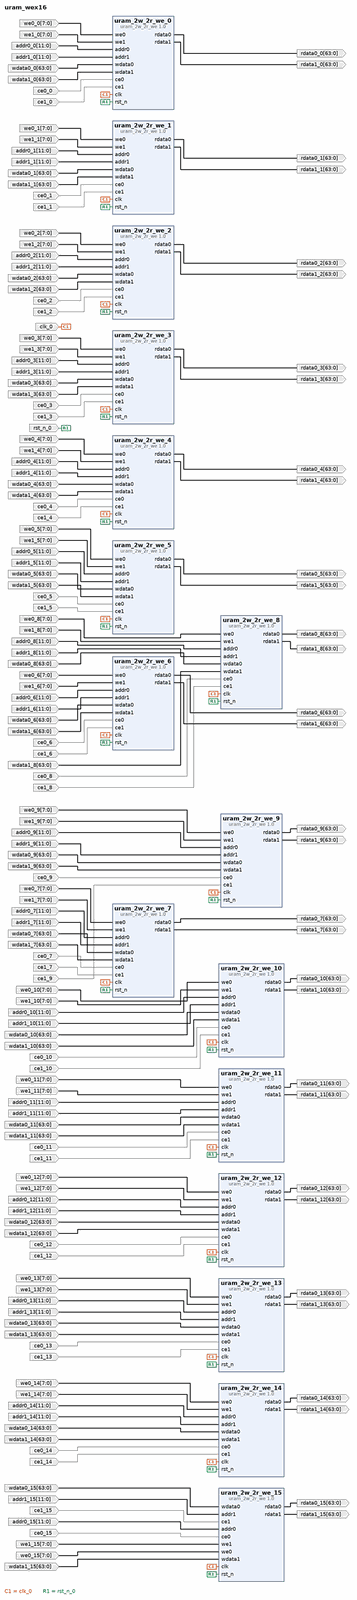
[diagram p0: block diagram of the top level, whole]
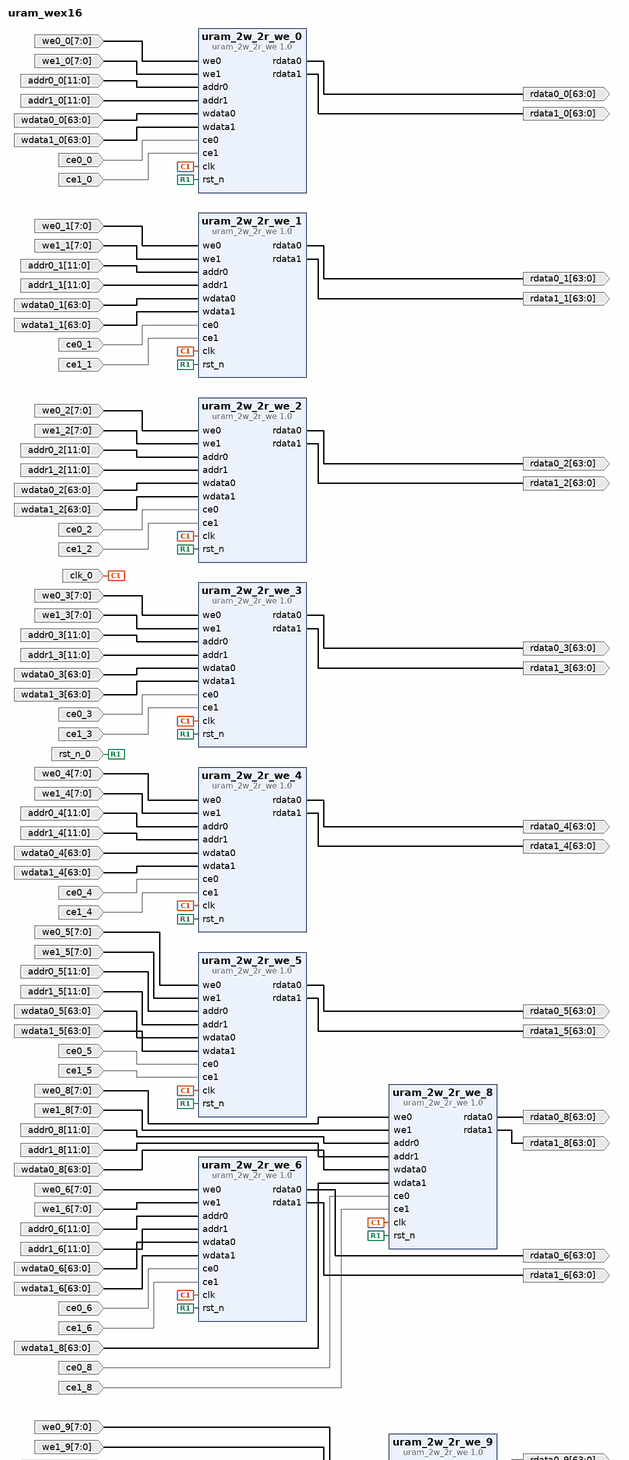
[diagram p1: block diagram of the top level, upper part]
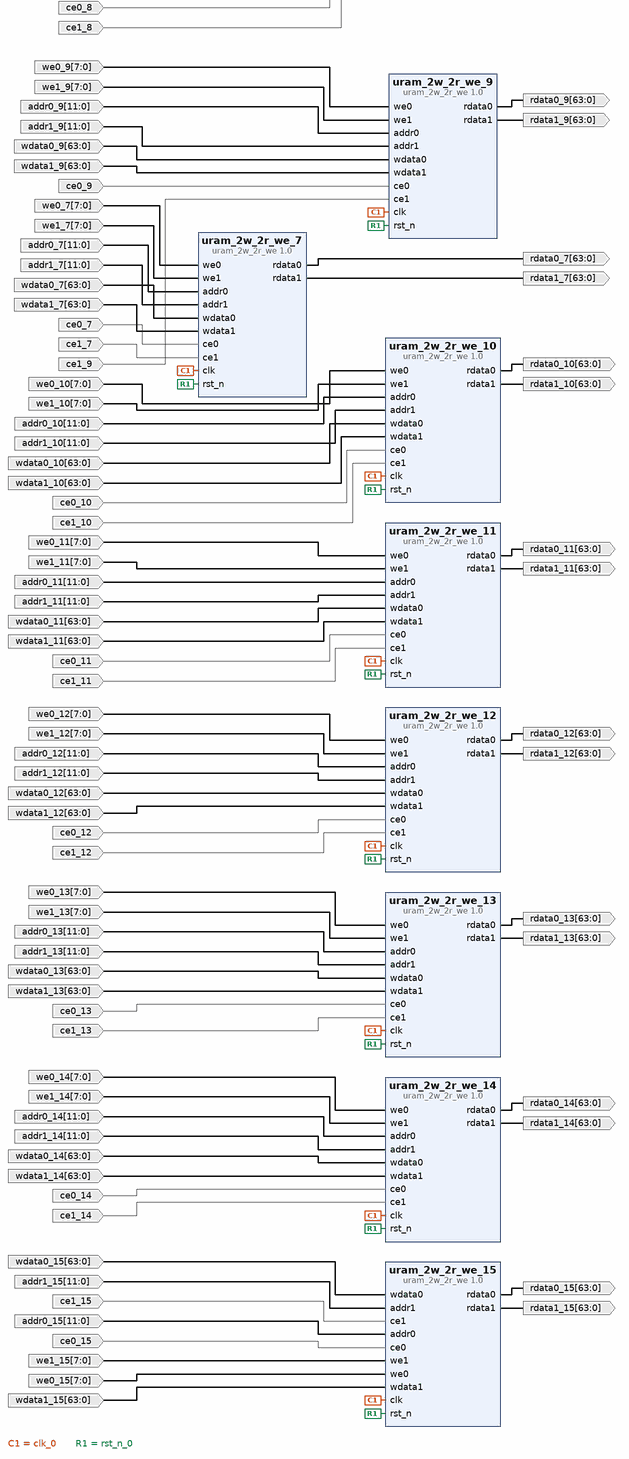
[diagram p2: block diagram of the top level, lower part]
# Vivado block design uram_wex16, xcu280-fsvh2892-2L-e, Vivado 2020.2
create_bd_design uram_wex16

create_bd_port -dir I -type clk clk_0
create_bd_port -dir I -type rst rst_n_0
create_bd_port -dir I -from 7 -to 0 we0_0
create_bd_port -dir I -from 7 -to 0 we1_0
create_bd_port -dir I -from 11 -to 0 addr0_0
create_bd_port -dir I -from 11 -to 0 addr1_0
create_bd_port -dir O -from 63 -to 0 rdata0_0
create_bd_port -dir O -from 63 -to 0 rdata1_0
create_bd_port -dir I -from 63 -to 0 wdata0_0
create_bd_port -dir I -from 63 -to 0 wdata1_0
create_bd_port -dir I ce0_0
create_bd_port -dir I ce1_0
create_bd_port -dir I -from 7 -to 0 we0_1
create_bd_port -dir I -from 7 -to 0 we1_1
create_bd_port -dir I -from 11 -to 0 addr0_1
create_bd_port -dir I -from 11 -to 0 addr1_1
create_bd_port -dir O -from 63 -to 0 rdata0_1
create_bd_port -dir O -from 63 -to 0 rdata1_1
create_bd_port -dir I -from 63 -to 0 wdata0_1
create_bd_port -dir I -from 63 -to 0 wdata1_1
create_bd_port -dir I ce0_1
create_bd_port -dir I ce1_1
create_bd_port -dir I -from 7 -to 0 we0_2
create_bd_port -dir I -from 7 -to 0 we1_2
create_bd_port -dir I -from 11 -to 0 addr0_2
create_bd_port -dir I -from 11 -to 0 addr1_2
create_bd_port -dir O -from 63 -to 0 rdata0_2
create_bd_port -dir O -from 63 -to 0 rdata1_2
create_bd_port -dir I -from 63 -to 0 wdata0_2
create_bd_port -dir I -from 63 -to 0 wdata1_2
create_bd_port -dir I ce0_2
create_bd_port -dir I ce1_2
create_bd_port -dir I -from 7 -to 0 we0_3
create_bd_port -dir I -from 7 -to 0 we1_3
create_bd_port -dir I -from 11 -to 0 addr0_3
create_bd_port -dir I -from 11 -to 0 addr1_3
create_bd_port -dir O -from 63 -to 0 rdata0_3
create_bd_port -dir O -from 63 -to 0 rdata1_3
create_bd_port -dir I -from 63 -to 0 wdata0_3
create_bd_port -dir I -from 63 -to 0 wdata1_3
create_bd_port -dir I ce0_3
create_bd_port -dir I ce1_3
create_bd_port -dir I -from 7 -to 0 we0_4
create_bd_port -dir I -from 7 -to 0 we1_4
create_bd_port -dir I -from 11 -to 0 addr0_4
create_bd_port -dir I -from 11 -to 0 addr1_4
create_bd_port -dir O -from 63 -to 0 rdata0_4
create_bd_port -dir O -from 63 -to 0 rdata1_4
create_bd_port -dir I -from 63 -to 0 wdata0_4
create_bd_port -dir I -from 63 -to 0 wdata1_4
create_bd_port -dir I ce0_4
create_bd_port -dir I ce1_4
create_bd_port -dir I -from 7 -to 0 we0_5
create_bd_port -dir I -from 7 -to 0 we1_5
create_bd_port -dir I -from 11 -to 0 addr0_5
create_bd_port -dir I -from 11 -to 0 addr1_5
create_bd_port -dir O -from 63 -to 0 rdata0_5
create_bd_port -dir O -from 63 -to 0 rdata1_5
create_bd_port -dir I -from 63 -to 0 wdata0_5
create_bd_port -dir I -from 63 -to 0 wdata1_5
create_bd_port -dir I ce0_5
create_bd_port -dir I ce1_5
create_bd_port -dir I -from 7 -to 0 we0_6
create_bd_port -dir I -from 7 -to 0 we1_6
create_bd_port -dir I -from 11 -to 0 addr0_6
create_bd_port -dir I -from 11 -to 0 addr1_6
create_bd_port -dir O -from 63 -to 0 rdata0_6
create_bd_port -dir O -from 63 -to 0 rdata1_6
create_bd_port -dir I -from 63 -to 0 wdata0_6
create_bd_port -dir I -from 63 -to 0 wdata1_6
create_bd_port -dir I ce0_6
create_bd_port -dir I ce1_6
create_bd_port -dir I -from 7 -to 0 we0_7
create_bd_port -dir I -from 7 -to 0 we1_7
create_bd_port -dir I -from 11 -to 0 addr0_7
create_bd_port -dir I -from 11 -to 0 addr1_7
create_bd_port -dir O -from 63 -to 0 rdata0_7
create_bd_port -dir O -from 63 -to 0 rdata1_7
create_bd_port -dir I -from 63 -to 0 wdata0_7
create_bd_port -dir I -from 63 -to 0 wdata1_7
create_bd_port -dir I ce0_7
create_bd_port -dir I ce1_7
create_bd_port -dir I -from 7 -to 0 we0_8
create_bd_port -dir I -from 7 -to 0 we1_8
create_bd_port -dir I -from 11 -to 0 addr0_8
create_bd_port -dir I -from 11 -to 0 addr1_8
create_bd_port -dir O -from 63 -to 0 rdata0_8
create_bd_port -dir O -from 63 -to 0 rdata1_8
create_bd_port -dir I -from 63 -to 0 wdata0_8
create_bd_port -dir I -from 63 -to 0 wdata1_8
create_bd_port -dir I ce0_8
create_bd_port -dir I ce1_8
create_bd_port -dir I -from 7 -to 0 we0_9
create_bd_port -dir I -from 7 -to 0 we1_9
create_bd_port -dir I -from 11 -to 0 addr0_9
create_bd_port -dir I -from 11 -to 0 addr1_9
create_bd_port -dir O -from 63 -to 0 rdata0_9
create_bd_port -dir O -from 63 -to 0 rdata1_9
create_bd_port -dir I -from 63 -to 0 wdata0_9
create_bd_port -dir I -from 63 -to 0 wdata1_9
create_bd_port -dir I ce0_9
create_bd_port -dir I ce1_9
create_bd_port -dir I -from 7 -to 0 we0_10
create_bd_port -dir I -from 7 -to 0 we1_10
create_bd_port -dir I -from 11 -to 0 addr0_10
create_bd_port -dir I -from 11 -to 0 addr1_10
create_bd_port -dir O -from 63 -to 0 rdata0_10
create_bd_port -dir O -from 63 -to 0 rdata1_10
create_bd_port -dir I -from 63 -to 0 wdata0_10
create_bd_port -dir I -from 63 -to 0 wdata1_10
create_bd_port -dir I ce0_10
create_bd_port -dir I ce1_10
create_bd_port -dir I -from 7 -to 0 we0_11
create_bd_port -dir I -from 7 -to 0 we1_11
create_bd_port -dir I -from 11 -to 0 addr0_11
create_bd_port -dir I -from 11 -to 0 addr1_11
create_bd_port -dir O -from 63 -to 0 rdata0_11
create_bd_port -dir O -from 63 -to 0 rdata1_11
create_bd_port -dir I -from 63 -to 0 wdata0_11
create_bd_port -dir I -from 63 -to 0 wdata1_11
create_bd_port -dir I ce0_11
create_bd_port -dir I ce1_11
create_bd_port -dir I -from 7 -to 0 we0_12
create_bd_port -dir I -from 7 -to 0 we1_12
create_bd_port -dir I -from 11 -to 0 addr0_12
create_bd_port -dir I -from 11 -to 0 addr1_12
create_bd_port -dir O -from 63 -to 0 rdata0_12
create_bd_port -dir O -from 63 -to 0 rdata1_12
create_bd_port -dir I -from 63 -to 0 wdata0_12
create_bd_port -dir I -from 63 -to 0 wdata1_12
create_bd_port -dir I ce0_12
create_bd_port -dir I ce1_12
create_bd_port -dir I -from 7 -to 0 we0_13
create_bd_port -dir I -from 7 -to 0 we1_13
create_bd_port -dir I -from 11 -to 0 addr0_13
create_bd_port -dir I -from 11 -to 0 addr1_13
create_bd_port -dir O -from 63 -to 0 rdata0_13
create_bd_port -dir O -from 63 -to 0 rdata1_13
create_bd_port -dir I -from 63 -to 0 wdata0_13
create_bd_port -dir I -from 63 -to 0 wdata1_13
create_bd_port -dir I ce0_13
create_bd_port -dir I ce1_13
create_bd_port -dir I -from 7 -to 0 we0_14
create_bd_port -dir I -from 7 -to 0 we1_14
create_bd_port -dir I -from 11 -to 0 addr0_14
create_bd_port -dir I -from 11 -to 0 addr1_14
create_bd_port -dir O -from 63 -to 0 rdata0_14
create_bd_port -dir O -from 63 -to 0 rdata1_14
create_bd_port -dir I -from 63 -to 0 wdata0_14
create_bd_port -dir I -from 63 -to 0 wdata1_14
create_bd_port -dir I ce0_14
create_bd_port -dir I ce1_14
create_bd_port -dir I -from 63 -to 0 wdata0_15
create_bd_port -dir O -from 63 -to 0 rdata1_15
create_bd_port -dir O -from 63 -to 0 rdata0_15
create_bd_port -dir I -from 11 -to 0 addr1_15
create_bd_port -dir I ce1_15
create_bd_port -dir I -from 11 -to 0 addr0_15
create_bd_port -dir I ce0_15
create_bd_port -dir I -from 7 -to 0 we1_15
create_bd_port -dir I -from 7 -to 0 we0_15
create_bd_port -dir I -from 63 -to 0 wdata1_15

create_bd_cell -type ip -vlnv user.org:user:uram_2w_2r_we:1.0 uram_2w_2r_we_0
create_bd_cell -type ip -vlnv user.org:user:uram_2w_2r_we:1.0 uram_2w_2r_we_1
create_bd_cell -type ip -vlnv user.org:user:uram_2w_2r_we:1.0 uram_2w_2r_we_2
create_bd_cell -type ip -vlnv user.org:user:uram_2w_2r_we:1.0 uram_2w_2r_we_4
create_bd_cell -type ip -vlnv user.org:user:uram_2w_2r_we:1.0 uram_2w_2r_we_11
create_bd_cell -type ip -vlnv user.org:user:uram_2w_2r_we:1.0 uram_2w_2r_we_12
create_bd_cell -type ip -vlnv user.org:user:uram_2w_2r_we:1.0 uram_2w_2r_we_13
create_bd_cell -type ip -vlnv user.org:user:uram_2w_2r_we:1.0 uram_2w_2r_we_14
create_bd_cell -type ip -vlnv user.org:user:uram_2w_2r_we:1.0 uram_2w_2r_we_15
create_bd_cell -type ip -vlnv user.org:user:uram_2w_2r_we:1.0 uram_2w_2r_we_3
create_bd_cell -type ip -vlnv user.org:user:uram_2w_2r_we:1.0 uram_2w_2r_we_5
create_bd_cell -type ip -vlnv user.org:user:uram_2w_2r_we:1.0 uram_2w_2r_we_6
create_bd_cell -type ip -vlnv user.org:user:uram_2w_2r_we:1.0 uram_2w_2r_we_7
create_bd_cell -type ip -vlnv user.org:user:uram_2w_2r_we:1.0 uram_2w_2r_we_8
create_bd_cell -type ip -vlnv user.org:user:uram_2w_2r_we:1.0 uram_2w_2r_we_9
create_bd_cell -type ip -vlnv user.org:user:uram_2w_2r_we:1.0 uram_2w_2r_we_10

# ---- connections ----

connect_bd_net -net clk_0_1 [get_bd_ports clk_0] \
  [get_bd_pins uram_2w_2r_we_0/clk] [get_bd_pins uram_2w_2r_we_1/clk] [get_bd_pins uram_2w_2r_we_2/clk] \
  [get_bd_pins uram_2w_2r_we_4/clk] [get_bd_pins uram_2w_2r_we_11/clk] [get_bd_pins uram_2w_2r_we_12/clk] \
  [get_bd_pins uram_2w_2r_we_13/clk] [get_bd_pins uram_2w_2r_we_14/clk] [get_bd_pins uram_2w_2r_we_15/clk] \
  [get_bd_pins uram_2w_2r_we_3/clk] [get_bd_pins uram_2w_2r_we_5/clk] [get_bd_pins uram_2w_2r_we_6/clk] \
  [get_bd_pins uram_2w_2r_we_7/clk] [get_bd_pins uram_2w_2r_we_8/clk] [get_bd_pins uram_2w_2r_we_9/clk] \
  [get_bd_pins uram_2w_2r_we_10/clk]
connect_bd_net -net rst_n_0_1 [get_bd_ports rst_n_0] \
  [get_bd_pins uram_2w_2r_we_0/rst_n] [get_bd_pins uram_2w_2r_we_1/rst_n] [get_bd_pins uram_2w_2r_we_2/rst_n] \
  [get_bd_pins uram_2w_2r_we_4/rst_n] [get_bd_pins uram_2w_2r_we_11/rst_n] [get_bd_pins uram_2w_2r_we_12/rst_n] \
  [get_bd_pins uram_2w_2r_we_13/rst_n] [get_bd_pins uram_2w_2r_we_14/rst_n] [get_bd_pins uram_2w_2r_we_15/rst_n] \
  [get_bd_pins uram_2w_2r_we_3/rst_n] [get_bd_pins uram_2w_2r_we_5/rst_n] [get_bd_pins uram_2w_2r_we_6/rst_n] \
  [get_bd_pins uram_2w_2r_we_7/rst_n] [get_bd_pins uram_2w_2r_we_8/rst_n] [get_bd_pins uram_2w_2r_we_9/rst_n] \
  [get_bd_pins uram_2w_2r_we_10/rst_n]
connect_bd_net -net we0_0_1 [get_bd_ports we0_0] [get_bd_pins uram_2w_2r_we_0/we0]
connect_bd_net -net we1_0_1 [get_bd_ports we1_0] [get_bd_pins uram_2w_2r_we_0/we1]
connect_bd_net -net addr0_0_1 [get_bd_ports addr0_0] [get_bd_pins uram_2w_2r_we_0/addr0]
connect_bd_net -net addr1_0_1 [get_bd_ports addr1_0] [get_bd_pins uram_2w_2r_we_0/addr1]
connect_bd_net [get_bd_pins uram_2w_2r_we_0/rdata0] [get_bd_ports rdata0_0]
connect_bd_net [get_bd_pins uram_2w_2r_we_0/rdata1] [get_bd_ports rdata1_0]
connect_bd_net -net wdata0_0_1 [get_bd_ports wdata0_0] [get_bd_pins uram_2w_2r_we_0/wdata0]
connect_bd_net -net wdata1_0_1 [get_bd_ports wdata1_0] [get_bd_pins uram_2w_2r_we_0/wdata1]
connect_bd_net -net ce0_0_1 [get_bd_ports ce0_0] [get_bd_pins uram_2w_2r_we_0/ce0]
connect_bd_net -net ce1_0_1 [get_bd_ports ce1_0] [get_bd_pins uram_2w_2r_we_0/ce1]
connect_bd_net -net we0_1_1 [get_bd_ports we0_1] [get_bd_pins uram_2w_2r_we_1/we0]
connect_bd_net -net we1_1_1 [get_bd_ports we1_1] [get_bd_pins uram_2w_2r_we_1/we1]
connect_bd_net -net addr0_1_1 [get_bd_ports addr0_1] [get_bd_pins uram_2w_2r_we_1/addr0]
connect_bd_net -net addr1_1_1 [get_bd_ports addr1_1] [get_bd_pins uram_2w_2r_we_1/addr1]
connect_bd_net [get_bd_pins uram_2w_2r_we_1/rdata0] [get_bd_ports rdata0_1]
connect_bd_net [get_bd_pins uram_2w_2r_we_1/rdata1] [get_bd_ports rdata1_1]
connect_bd_net -net wdata0_1_1 [get_bd_ports wdata0_1] [get_bd_pins uram_2w_2r_we_1/wdata0]
connect_bd_net -net wdata1_1_1 [get_bd_ports wdata1_1] [get_bd_pins uram_2w_2r_we_1/wdata1]
connect_bd_net -net ce0_1_1 [get_bd_ports ce0_1] [get_bd_pins uram_2w_2r_we_1/ce0]
connect_bd_net -net ce1_1_1 [get_bd_ports ce1_1] [get_bd_pins uram_2w_2r_we_1/ce1]
connect_bd_net -net we0_2_1 [get_bd_ports we0_2] [get_bd_pins uram_2w_2r_we_2/we0]
connect_bd_net -net we1_2_1 [get_bd_ports we1_2] [get_bd_pins uram_2w_2r_we_2/we1]
connect_bd_net -net addr0_2_1 [get_bd_ports addr0_2] [get_bd_pins uram_2w_2r_we_2/addr0]
connect_bd_net -net addr1_2_1 [get_bd_ports addr1_2] [get_bd_pins uram_2w_2r_we_2/addr1]
connect_bd_net [get_bd_pins uram_2w_2r_we_2/rdata0] [get_bd_ports rdata0_2]
connect_bd_net [get_bd_pins uram_2w_2r_we_2/rdata1] [get_bd_ports rdata1_2]
connect_bd_net -net wdata0_2_1 [get_bd_ports wdata0_2] [get_bd_pins uram_2w_2r_we_2/wdata0]
connect_bd_net -net wdata1_2_1 [get_bd_ports wdata1_2] [get_bd_pins uram_2w_2r_we_2/wdata1]
connect_bd_net -net ce0_2_1 [get_bd_ports ce0_2] [get_bd_pins uram_2w_2r_we_2/ce0]
connect_bd_net -net ce1_2_1 [get_bd_ports ce1_2] [get_bd_pins uram_2w_2r_we_2/ce1]
connect_bd_net -net we0_3_1 [get_bd_ports we0_3] [get_bd_pins uram_2w_2r_we_3/we0]
connect_bd_net -net we1_3_1 [get_bd_ports we1_3] [get_bd_pins uram_2w_2r_we_3/we1]
connect_bd_net -net addr0_3_1 [get_bd_ports addr0_3] [get_bd_pins uram_2w_2r_we_3/addr0]
connect_bd_net -net addr1_3_1 [get_bd_ports addr1_3] [get_bd_pins uram_2w_2r_we_3/addr1]
connect_bd_net [get_bd_pins uram_2w_2r_we_3/rdata0] [get_bd_ports rdata0_3]
connect_bd_net [get_bd_pins uram_2w_2r_we_3/rdata1] [get_bd_ports rdata1_3]
connect_bd_net -net wdata0_3_1 [get_bd_ports wdata0_3] [get_bd_pins uram_2w_2r_we_3/wdata0]
connect_bd_net -net wdata1_3_1 [get_bd_ports wdata1_3] [get_bd_pins uram_2w_2r_we_3/wdata1]
connect_bd_net -net ce0_3_1 [get_bd_ports ce0_3] [get_bd_pins uram_2w_2r_we_3/ce0]
connect_bd_net -net ce1_3_1 [get_bd_ports ce1_3] [get_bd_pins uram_2w_2r_we_3/ce1]
connect_bd_net -net we0_4_1 [get_bd_ports we0_4] [get_bd_pins uram_2w_2r_we_4/we0]
connect_bd_net -net we1_4_1 [get_bd_ports we1_4] [get_bd_pins uram_2w_2r_we_4/we1]
connect_bd_net -net addr0_4_1 [get_bd_ports addr0_4] [get_bd_pins uram_2w_2r_we_4/addr0]
connect_bd_net -net addr1_4_1 [get_bd_ports addr1_4] [get_bd_pins uram_2w_2r_we_4/addr1]
connect_bd_net [get_bd_pins uram_2w_2r_we_4/rdata0] [get_bd_ports rdata0_4]
connect_bd_net [get_bd_pins uram_2w_2r_we_4/rdata1] [get_bd_ports rdata1_4]
connect_bd_net -net wdata0_4_1 [get_bd_ports wdata0_4] [get_bd_pins uram_2w_2r_we_4/wdata0]
connect_bd_net -net wdata1_4_1 [get_bd_ports wdata1_4] [get_bd_pins uram_2w_2r_we_4/wdata1]
connect_bd_net -net ce0_4_1 [get_bd_ports ce0_4] [get_bd_pins uram_2w_2r_we_4/ce0]
connect_bd_net -net ce1_4_1 [get_bd_ports ce1_4] [get_bd_pins uram_2w_2r_we_4/ce1]
connect_bd_net -net we0_5_1 [get_bd_ports we0_5] [get_bd_pins uram_2w_2r_we_5/we0]
connect_bd_net -net we1_5_1 [get_bd_ports we1_5] [get_bd_pins uram_2w_2r_we_5/we1]
connect_bd_net -net addr0_5_1 [get_bd_ports addr0_5] [get_bd_pins uram_2w_2r_we_5/addr0]
connect_bd_net -net addr1_5_1 [get_bd_ports addr1_5] [get_bd_pins uram_2w_2r_we_5/addr1]
connect_bd_net [get_bd_pins uram_2w_2r_we_5/rdata0] [get_bd_ports rdata0_5]
connect_bd_net [get_bd_pins uram_2w_2r_we_5/rdata1] [get_bd_ports rdata1_5]
connect_bd_net -net wdata0_5_1 [get_bd_ports wdata0_5] [get_bd_pins uram_2w_2r_we_5/wdata0]
connect_bd_net -net wdata1_5_1 [get_bd_ports wdata1_5] [get_bd_pins uram_2w_2r_we_5/wdata1]
connect_bd_net -net ce0_5_1 [get_bd_ports ce0_5] [get_bd_pins uram_2w_2r_we_5/ce0]
connect_bd_net -net ce1_5_1 [get_bd_ports ce1_5] [get_bd_pins uram_2w_2r_we_5/ce1]
connect_bd_net -net we0_6_1 [get_bd_ports we0_6] [get_bd_pins uram_2w_2r_we_6/we0]
connect_bd_net -net we1_6_1 [get_bd_ports we1_6] [get_bd_pins uram_2w_2r_we_6/we1]
connect_bd_net -net addr0_6_1 [get_bd_ports addr0_6] [get_bd_pins uram_2w_2r_we_6/addr0]
connect_bd_net -net addr1_6_1 [get_bd_ports addr1_6] [get_bd_pins uram_2w_2r_we_6/addr1]
connect_bd_net [get_bd_pins uram_2w_2r_we_6/rdata0] [get_bd_ports rdata0_6]
connect_bd_net [get_bd_pins uram_2w_2r_we_6/rdata1] [get_bd_ports rdata1_6]
connect_bd_net -net wdata0_6_1 [get_bd_ports wdata0_6] [get_bd_pins uram_2w_2r_we_6/wdata0]
connect_bd_net -net wdata1_6_1 [get_bd_ports wdata1_6] [get_bd_pins uram_2w_2r_we_6/wdata1]
connect_bd_net -net ce0_6_1 [get_bd_ports ce0_6] [get_bd_pins uram_2w_2r_we_6/ce0]
connect_bd_net -net ce1_6_1 [get_bd_ports ce1_6] [get_bd_pins uram_2w_2r_we_6/ce1]
connect_bd_net -net we0_7_1 [get_bd_ports we0_7] [get_bd_pins uram_2w_2r_we_7/we0]
connect_bd_net -net we1_7_1 [get_bd_ports we1_7] [get_bd_pins uram_2w_2r_we_7/we1]
connect_bd_net -net addr0_7_1 [get_bd_ports addr0_7] [get_bd_pins uram_2w_2r_we_7/addr0]
connect_bd_net -net addr1_7_1 [get_bd_ports addr1_7] [get_bd_pins uram_2w_2r_we_7/addr1]
connect_bd_net [get_bd_pins uram_2w_2r_we_7/rdata0] [get_bd_ports rdata0_7]
connect_bd_net [get_bd_pins uram_2w_2r_we_7/rdata1] [get_bd_ports rdata1_7]
connect_bd_net -net wdata0_7_1 [get_bd_ports wdata0_7] [get_bd_pins uram_2w_2r_we_7/wdata0]
connect_bd_net -net wdata1_7_1 [get_bd_ports wdata1_7] [get_bd_pins uram_2w_2r_we_7/wdata1]
connect_bd_net -net ce0_7_1 [get_bd_ports ce0_7] [get_bd_pins uram_2w_2r_we_7/ce0]
connect_bd_net -net ce1_7_1 [get_bd_ports ce1_7] [get_bd_pins uram_2w_2r_we_7/ce1]
connect_bd_net -net we0_8_1 [get_bd_ports we0_8] [get_bd_pins uram_2w_2r_we_8/we0]
connect_bd_net -net we1_8_1 [get_bd_ports we1_8] [get_bd_pins uram_2w_2r_we_8/we1]
connect_bd_net -net addr0_8_1 [get_bd_ports addr0_8] [get_bd_pins uram_2w_2r_we_8/addr0]
connect_bd_net -net addr1_8_1 [get_bd_ports addr1_8] [get_bd_pins uram_2w_2r_we_8/addr1]
connect_bd_net [get_bd_pins uram_2w_2r_we_8/rdata0] [get_bd_ports rdata0_8]
connect_bd_net [get_bd_pins uram_2w_2r_we_8/rdata1] [get_bd_ports rdata1_8]
connect_bd_net -net wdata0_8_1 [get_bd_ports wdata0_8] [get_bd_pins uram_2w_2r_we_8/wdata0]
connect_bd_net -net wdata1_8_1 [get_bd_ports wdata1_8] [get_bd_pins uram_2w_2r_we_8/wdata1]
connect_bd_net -net ce0_8_1 [get_bd_ports ce0_8] [get_bd_pins uram_2w_2r_we_8/ce0]
connect_bd_net -net ce1_8_1 [get_bd_ports ce1_8] [get_bd_pins uram_2w_2r_we_8/ce1]
connect_bd_net -net we0_9_1 [get_bd_ports we0_9] [get_bd_pins uram_2w_2r_we_9/we0]
connect_bd_net -net we1_9_1 [get_bd_ports we1_9] [get_bd_pins uram_2w_2r_we_9/we1]
connect_bd_net -net addr0_9_1 [get_bd_ports addr0_9] [get_bd_pins uram_2w_2r_we_9/addr0]
connect_bd_net -net addr1_9_1 [get_bd_ports addr1_9] [get_bd_pins uram_2w_2r_we_9/addr1]
connect_bd_net [get_bd_pins uram_2w_2r_we_9/rdata0] [get_bd_ports rdata0_9]
connect_bd_net [get_bd_pins uram_2w_2r_we_9/rdata1] [get_bd_ports rdata1_9]
connect_bd_net -net wdata0_9_1 [get_bd_ports wdata0_9] [get_bd_pins uram_2w_2r_we_9/wdata0]
connect_bd_net -net wdata1_9_1 [get_bd_ports wdata1_9] [get_bd_pins uram_2w_2r_we_9/wdata1]
connect_bd_net -net ce0_9_1 [get_bd_ports ce0_9] [get_bd_pins uram_2w_2r_we_9/ce0]
connect_bd_net -net ce1_9_1 [get_bd_ports ce1_9] [get_bd_pins uram_2w_2r_we_9/ce1]
connect_bd_net -net we0_10_1 [get_bd_ports we0_10] [get_bd_pins uram_2w_2r_we_10/we0]
connect_bd_net -net we1_10_1 [get_bd_ports we1_10] [get_bd_pins uram_2w_2r_we_10/we1]
connect_bd_net -net addr0_10_1 [get_bd_ports addr0_10] [get_bd_pins uram_2w_2r_we_10/addr0]
connect_bd_net -net addr1_10_1 [get_bd_ports addr1_10] [get_bd_pins uram_2w_2r_we_10/addr1]
connect_bd_net [get_bd_pins uram_2w_2r_we_10/rdata0] [get_bd_ports rdata0_10]
connect_bd_net [get_bd_pins uram_2w_2r_we_10/rdata1] [get_bd_ports rdata1_10]
connect_bd_net -net wdata0_10_1 [get_bd_ports wdata0_10] [get_bd_pins uram_2w_2r_we_10/wdata0]
connect_bd_net -net wdata1_10_1 [get_bd_ports wdata1_10] [get_bd_pins uram_2w_2r_we_10/wdata1]
connect_bd_net -net ce0_10_1 [get_bd_ports ce0_10] [get_bd_pins uram_2w_2r_we_10/ce0]
connect_bd_net -net ce1_10_1 [get_bd_ports ce1_10] [get_bd_pins uram_2w_2r_we_10/ce1]
connect_bd_net -net we0_11_1 [get_bd_ports we0_11] [get_bd_pins uram_2w_2r_we_11/we0]
connect_bd_net -net we1_11_1 [get_bd_ports we1_11] [get_bd_pins uram_2w_2r_we_11/we1]
connect_bd_net -net addr0_11_1 [get_bd_ports addr0_11] [get_bd_pins uram_2w_2r_we_11/addr0]
connect_bd_net -net addr1_11_1 [get_bd_ports addr1_11] [get_bd_pins uram_2w_2r_we_11/addr1]
connect_bd_net [get_bd_pins uram_2w_2r_we_11/rdata0] [get_bd_ports rdata0_11]
connect_bd_net [get_bd_pins uram_2w_2r_we_11/rdata1] [get_bd_ports rdata1_11]
connect_bd_net -net wdata0_11_1 [get_bd_ports wdata0_11] [get_bd_pins uram_2w_2r_we_11/wdata0]
connect_bd_net -net wdata1_11_1 [get_bd_ports wdata1_11] [get_bd_pins uram_2w_2r_we_11/wdata1]
connect_bd_net -net ce0_11_1 [get_bd_ports ce0_11] [get_bd_pins uram_2w_2r_we_11/ce0]
connect_bd_net -net ce1_11_1 [get_bd_ports ce1_11] [get_bd_pins uram_2w_2r_we_11/ce1]
connect_bd_net -net we0_12_1 [get_bd_ports we0_12] [get_bd_pins uram_2w_2r_we_12/we0]
connect_bd_net -net we1_12_1 [get_bd_ports we1_12] [get_bd_pins uram_2w_2r_we_12/we1]
connect_bd_net -net addr0_12_1 [get_bd_ports addr0_12] [get_bd_pins uram_2w_2r_we_12/addr0]
connect_bd_net -net addr1_12_1 [get_bd_ports addr1_12] [get_bd_pins uram_2w_2r_we_12/addr1]
connect_bd_net [get_bd_pins uram_2w_2r_we_12/rdata0] [get_bd_ports rdata0_12]
connect_bd_net [get_bd_pins uram_2w_2r_we_12/rdata1] [get_bd_ports rdata1_12]
connect_bd_net -net wdata0_12_1 [get_bd_ports wdata0_12] [get_bd_pins uram_2w_2r_we_12/wdata0]
connect_bd_net -net wdata1_12_1 [get_bd_ports wdata1_12] [get_bd_pins uram_2w_2r_we_12/wdata1]
connect_bd_net -net ce0_12_1 [get_bd_ports ce0_12] [get_bd_pins uram_2w_2r_we_12/ce0]
connect_bd_net -net ce1_12_1 [get_bd_ports ce1_12] [get_bd_pins uram_2w_2r_we_12/ce1]
connect_bd_net -net we0_13_1 [get_bd_ports we0_13] [get_bd_pins uram_2w_2r_we_13/we0]
connect_bd_net -net we1_13_1 [get_bd_ports we1_13] [get_bd_pins uram_2w_2r_we_13/we1]
connect_bd_net -net addr0_13_1 [get_bd_ports addr0_13] [get_bd_pins uram_2w_2r_we_13/addr0]
connect_bd_net -net addr1_13_1 [get_bd_ports addr1_13] [get_bd_pins uram_2w_2r_we_13/addr1]
connect_bd_net [get_bd_pins uram_2w_2r_we_13/rdata0] [get_bd_ports rdata0_13]
connect_bd_net [get_bd_pins uram_2w_2r_we_13/rdata1] [get_bd_ports rdata1_13]
connect_bd_net -net wdata0_13_1 [get_bd_ports wdata0_13] [get_bd_pins uram_2w_2r_we_13/wdata0]
connect_bd_net -net wdata1_13_1 [get_bd_ports wdata1_13] [get_bd_pins uram_2w_2r_we_13/wdata1]
connect_bd_net -net ce0_13_1 [get_bd_ports ce0_13] [get_bd_pins uram_2w_2r_we_13/ce0]
connect_bd_net -net ce1_13_1 [get_bd_ports ce1_13] [get_bd_pins uram_2w_2r_we_13/ce1]
connect_bd_net -net we0_14_1 [get_bd_ports we0_14] [get_bd_pins uram_2w_2r_we_14/we0]
connect_bd_net -net we1_14_1 [get_bd_ports we1_14] [get_bd_pins uram_2w_2r_we_14/we1]
connect_bd_net -net addr0_14_1 [get_bd_ports addr0_14] [get_bd_pins uram_2w_2r_we_14/addr0]
connect_bd_net -net addr1_14_1 [get_bd_ports addr1_14] [get_bd_pins uram_2w_2r_we_14/addr1]
connect_bd_net [get_bd_pins uram_2w_2r_we_14/rdata0] [get_bd_ports rdata0_14]
connect_bd_net [get_bd_pins uram_2w_2r_we_14/rdata1] [get_bd_ports rdata1_14]
connect_bd_net -net wdata0_14_1 [get_bd_ports wdata0_14] [get_bd_pins uram_2w_2r_we_14/wdata0]
connect_bd_net -net wdata1_14_1 [get_bd_ports wdata1_14] [get_bd_pins uram_2w_2r_we_14/wdata1]
connect_bd_net -net ce0_14_1 [get_bd_ports ce0_14] [get_bd_pins uram_2w_2r_we_14/ce0]
connect_bd_net -net ce1_14_1 [get_bd_ports ce1_14] [get_bd_pins uram_2w_2r_we_14/ce1]
connect_bd_net -net wdata0_15_1 [get_bd_ports wdata0_15] [get_bd_pins uram_2w_2r_we_15/wdata0]
connect_bd_net [get_bd_pins uram_2w_2r_we_15/rdata1] [get_bd_ports rdata1_15]
connect_bd_net [get_bd_pins uram_2w_2r_we_15/rdata0] [get_bd_ports rdata0_15]
connect_bd_net -net addr1_15_1 [get_bd_ports addr1_15] [get_bd_pins uram_2w_2r_we_15/addr1]
connect_bd_net -net ce1_15_1 [get_bd_ports ce1_15] [get_bd_pins uram_2w_2r_we_15/ce1]
connect_bd_net -net addr0_15_1 [get_bd_ports addr0_15] [get_bd_pins uram_2w_2r_we_15/addr0]
connect_bd_net -net ce0_15_1 [get_bd_ports ce0_15] [get_bd_pins uram_2w_2r_we_15/ce0]
connect_bd_net -net we1_15_1 [get_bd_ports we1_15] [get_bd_pins uram_2w_2r_we_15/we1]
connect_bd_net -net we0_15_1 [get_bd_ports we0_15] [get_bd_pins uram_2w_2r_we_15/we0]
connect_bd_net -net wdata1_15_1 [get_bd_ports wdata1_15] [get_bd_pins uram_2w_2r_we_15/wdata1]

validate_bd_design
save_bd_design
